# EAGLE board tinylab_09-03-16 (EAGLE 7.5.0), part 1 of 2
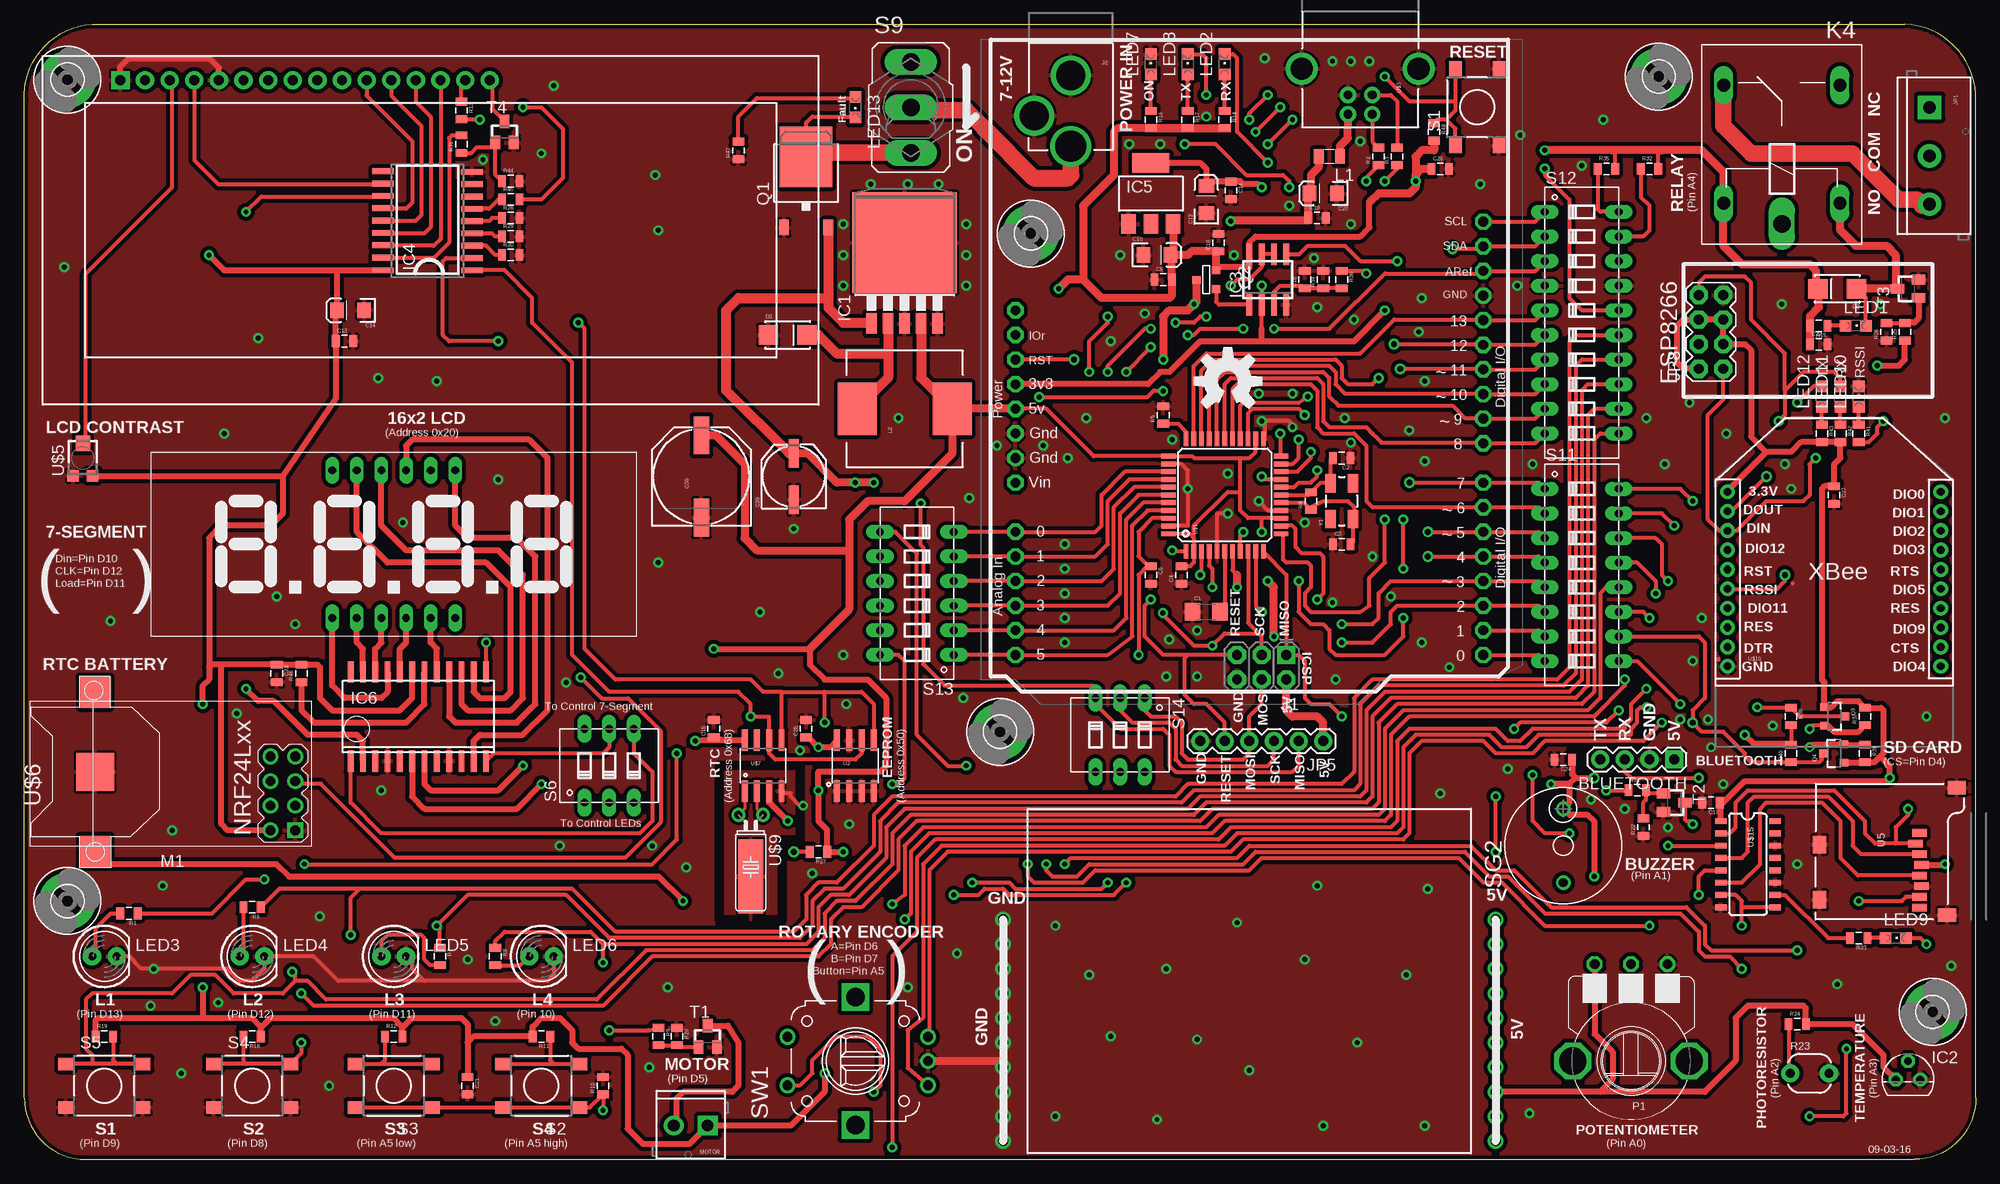
[diagram p2: board, top side]
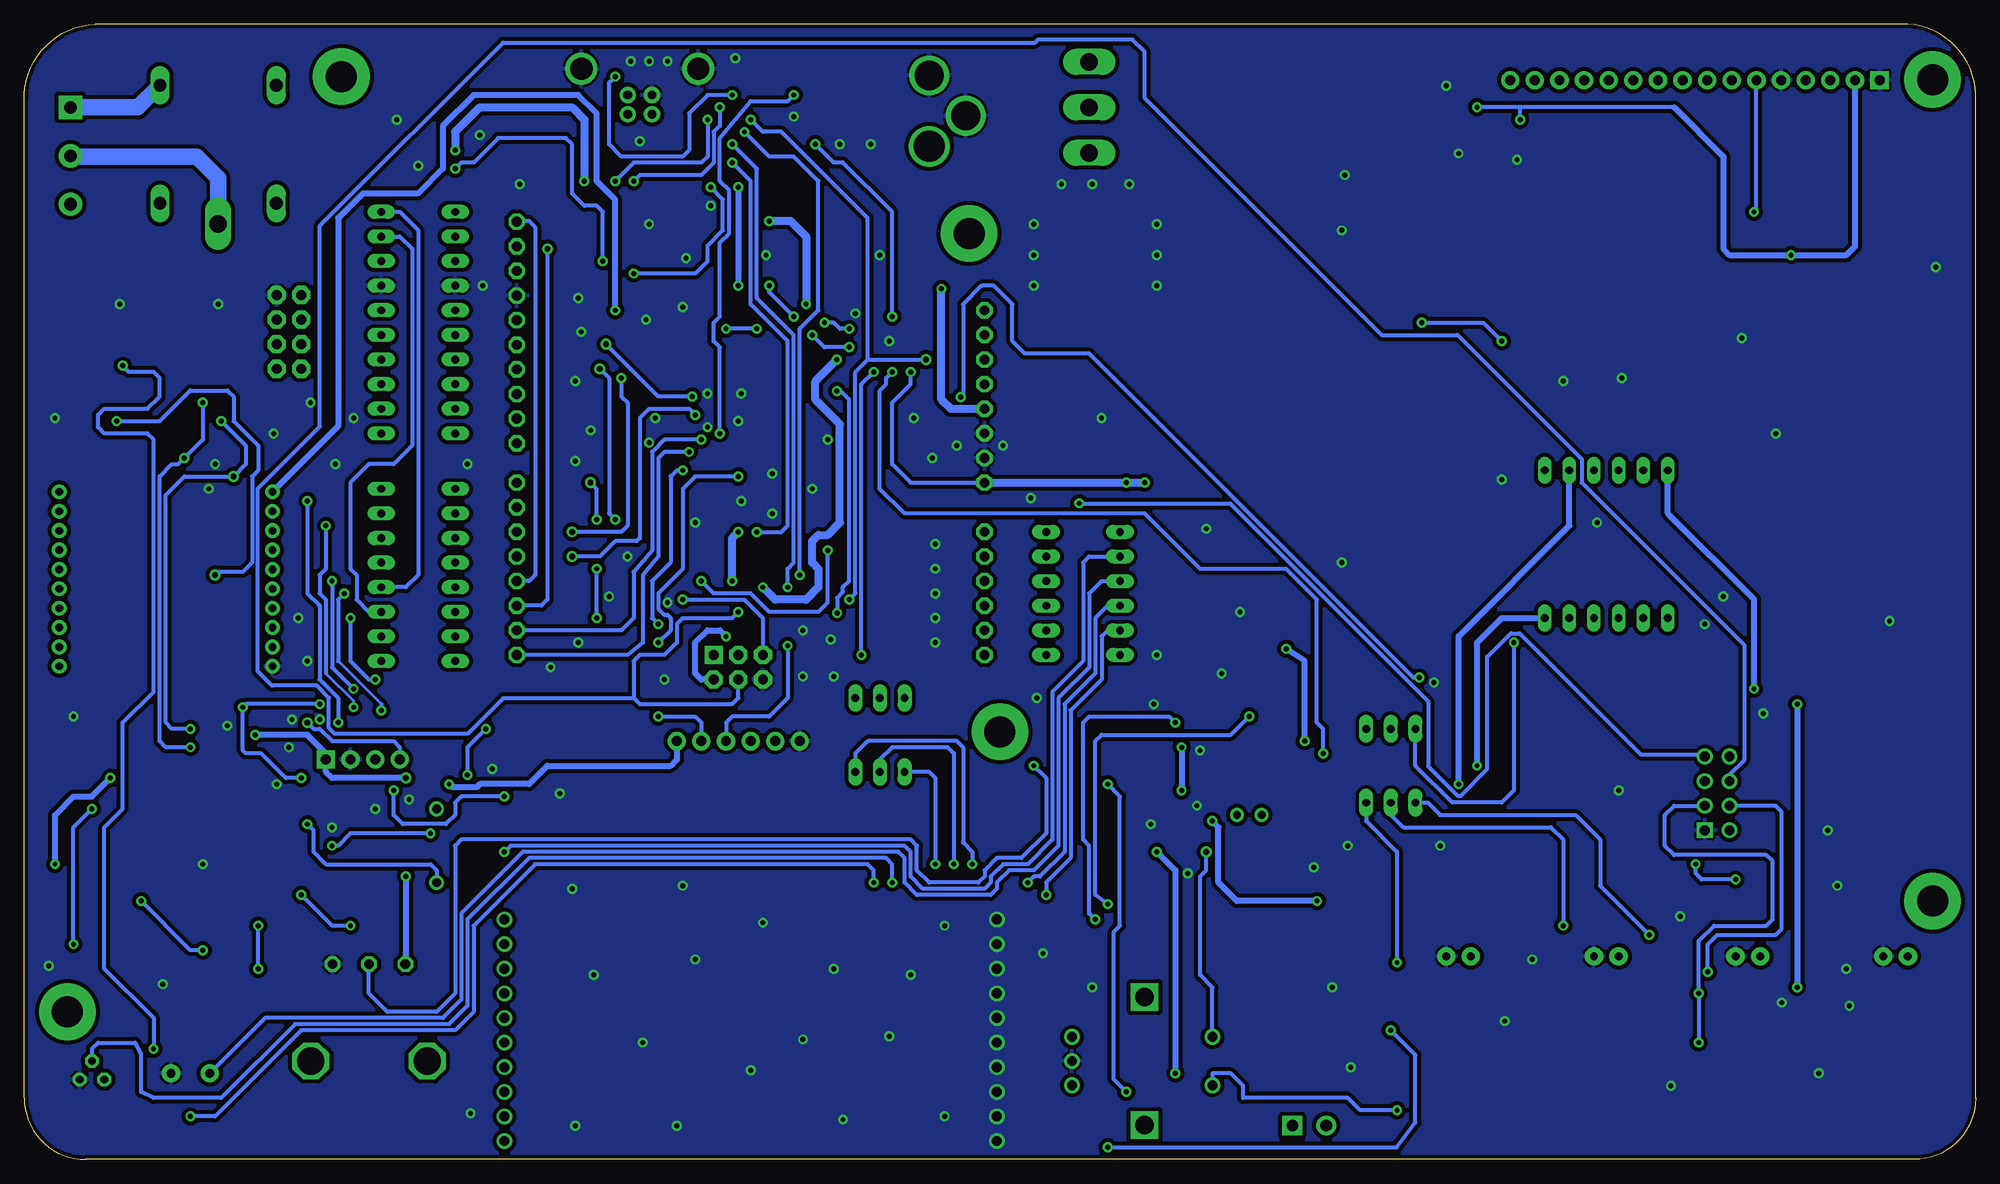
[diagram p3: board, bottom side, seen from below]

Size 201.31 x 117.16 mm. Coordinates in mm from the lower left corner, seen from the top.
Outline: 201.29,6.35 201.29,109.52
Outline: 201.31,6.35 arc-90 194.96,0 6.36,0 arc-90 0.01,6.35 0.01,109.22 arc-90 7,117.16 194,117.16 arc-90 201.31,109.22
Copper layers (1*16): Top 0.035mm / dielectric 1.5mm / Bottom 0.035mm
Design rules "default": minimum track width 16mil, minimum drill 20mil, track to track 8mil, track to pad 12mil, pad to pad 8mil, via to via 8mil, smd to smd 8mil, copper to edge 10mil, drill to drill 8mil, minimum pad ring 12mil, minimum via ring 10mil, stop-mask expansion 4mil, vias tented up to drill 25mil, thermal gap 10mil
tRestrict: 7 lines

## Footprints (pad centres in the part's own frame; a part is rotated, then mirrored left to right if it is on the bottom)
1X04 = drill 1.016 pad 1.88 square: 1 0,0 | drill 1.016 pad 1.88: 2 2.54,0; 3 5.08,0; 4 7.62,0
1206 = smd 1.6 x 1.8: 1 -1.4,0; 2 1.4,0
0805 = smd 0.8 x 1.2: 1 -0.9,0; 2 0.9,0
EIA3216 = smd 1.4 x 1.6: A 1.4,0; C -1.4,0
NIPPON_F80 = smd 2.95 x 1: + 2.4,0; - -2.4,0
PANASONIC_G = smd 3.9 x 1.6: + 4.25,0; - -4.25,0
SMA-DIODE_ALT = smd 2 x 2: A -2,0; C 2,0
3,2-PAD = drill 3.2 pad 5.842: B3,2 0,0
TO263-5 = smd 1.067 x 2.159: 1 -3.404,-5.791; 2 -1.702,-5.791; 3 0,-5.791; 4 1.702,-5.791; 5 3.404,-5.791 | smd 10.8 x 10.41: GND 0,2.54
TO92 = drill 0.813 octagon: 1 -1.27,0; 2 0,1.905; 3 1.27,0
SO08 = smd 0.6 x 2.2: 1 -1.905,-2.6; 2 -0.635,-2.6; 3 0.635,-2.6; 4 1.905,-2.6; 5 1.905,2.6; 6 0.635,2.6; 7 -0.635,2.6; 8 -1.905,2.6
SO18W = smd 0.6 x 2.2: 1 -4.445,-4.6; 2 -3.175,-4.6; 3 -1.905,-4.6; 4 -0.635,-4.6; 5 0.635,-4.6; 6 1.905,-4.6; 7 3.175,-4.6; 8 4.445,-4.6; 9 5.715,-4.6; 10 5.775,4.6; 11 4.505,4.6; 12 3.235,4.6; 13 1.965,4.6; 14 0.695,4.6; 15 -0.575,4.6; 16 -1.845,4.6; 17 -3.145,4.6; 18 -4.445,4.6
SOT223 = smd 1.5 x 2: 1 -2.3,-3.15; 2 0,-3.15; 3 2.3,-3.15 | smd 3.8 x 2: 4 0,3.15
SO24W = smd 0.6 x 2.2: 1 -6.985,-4.6; 2 -5.715,-4.6; 3 -4.445,-4.6; 4 -3.175,-4.6; 5 -1.905,-4.6; 6 -0.635,-4.6; 7 0.635,-4.6; 8 1.905,-4.6; 9 3.175,-4.6; 10 4.445,-4.6; 11 5.715,-4.6; 12 6.985,-4.6; 13 6.985,4.6; 14 5.715,4.6; 15 4.445,4.6; 16 3.175,4.6; 17 1.905,4.6; 18 0.635,4.6; 19 -0.635,4.6; 20 -1.905,4.6; 21 -3.175,4.6; 22 -4.445,4.6; 23 -5.715,4.6; 24 -6.985,4.6
2X3-NS = drill 1.016 pad 1.88 square: 1 -2.54,-1.27 | drill 1.016 pad 1.88 octagon: 2 -2.54,1.27; 3 0,-1.27; 4 0,1.27; 5 2.54,-1.27; 6 2.54,1.27
POWER_JACK_PTH_LOCK = drill 2.997 pad 4.115: GND 0.025,6.557; GNDBREAK 3.762,10.7 | drill 3.2 pad 4.115: PWR 0,13.878
SCREWTERMINAL-5MM-3 = drill 1.3 pad 2.413 square: 1 0,0 | drill 1.3 pad 2.413: 2 5,0; 3 10,0
1X06 = drill 1.016 pad 1.88: 1 0,0; 2 2.54,0; 3 5.08,0; 4 7.62,0; 5 10.16,0; 6 12.7,0
2X4 = drill 1.016 pad 1.88 octagon: 1 -3.81,-1.27; 2 -3.81,1.27; 3 -1.27,-1.27; 4 -1.27,1.27; 5 1.27,-1.27; 6 1.27,1.27; 7 3.81,-1.27; 8 3.81,1.27
ZF112 = drill 1.321 long: 1 -6.096,5.994; 2 -6.096,-5.994; O 6.096,5.994; S 6.096,-5.994 | drill 1.803 long: P -8.204,0
PTC0805 = smd 1 x 1.5: 1 -1.1,0; 2 1.1,0
CDRH125 = smd 5.4 x 4: 1 0,4.9; 2 0,-4.9
CHIPLED_0805 = smd 1.2 x 1.2: A 0,-1.05; C 0,1.05
LED5MM = drill 0.813 pad 1.88: A -1.27,0; K 1.27,0
WIRELESS-NRF24L01 = drill 1 square: 1 -12.7,6.35 | drill 1: 2 -10.16,6.35; 3 -12.7,3.81; 4 -10.16,3.81; 5 -12.7,1.27; 6 -10.16,1.27; 7 -12.7,-1.27; 8 -10.16,-1.27
SCREWTERMINAL-3.5MM-2 = drill 1.2 pad 2.032 square: 1 0,0 | drill 1.2 pad 2.032: 2 3.5,0
P120PK = drill 1 octagon: A -3.75,-10; E 3.75,-10; S 0,-10 | drill 2.8 octagon: M1 -6,0; M2 6,0
TO252 = smd 1 x 1.6: 1 -2.28,-4.8; 2 2.28,-4.8 | smd 5.4 x 6.2: 3 0,2.5
SOT-23 = smd 0.787 x 0.889: 1 0.025,-1.016; 2 -0.94,1.016; 3 0.991,1.016
SOT23-3 = smd 0.8 x 0.9: 1 -0.95,-1; 2 0.95,-1; 3 0,1.1
PHOTOCELL-KIT = drill 0.9 pad 1.88: 1 -2,0; 2 2,0
DTSM-6 = smd 1.55 x 1.3: 1 -3.975,2.25; 2 3.975,2.25; 3 -3.975,-2.25; 4 3.975,-2.25
DIP03YL = drill 0.813 long: 1 -2.54,-3.81; 2 0,-3.81; 3 2.54,-3.81; 4 2.54,3.81; 5 0,3.81; 6 -2.54,3.81
M9040P = drill 1.803 long: 1 0,4.699; 2 0,0; 3 0,-4.699
DIP08YL = drill 0.813 long: 1 -8.89,-3.81; 2 -6.35,-3.81; 3 -3.81,-3.81; 4 -1.27,-3.81; 5 1.27,-3.81; 6 3.81,-3.81; 7 6.35,-3.81; 8 8.89,-3.81; 9 8.89,3.81; 10 6.35,3.81; 11 3.81,3.81; 12 1.27,3.81; 13 -1.27,3.81; 14 -3.81,3.81; 15 -6.35,3.81; 16 -8.89,3.81
DIP10YL = drill 0.813 long: 1 -11.43,-3.81; 2 -8.89,-3.81; 3 -6.35,-3.81; 4 -3.81,-3.81; 5 -1.27,-3.81; 6 1.27,-3.81; 7 3.81,-3.81; 8 6.35,-3.81; 9 8.89,-3.81; 10 11.43,-3.81; 11 11.43,3.81; 12 8.89,3.81; 13 6.35,3.81; 14 3.81,3.81; 15 1.27,3.81; 16 -1.27,3.81; 17 -3.81,3.81; 18 -6.35,3.81; 19 -8.89,3.81; 20 -11.43,3.81
DIP06YL = drill 0.813 long: 1 -6.35,-3.81; 2 -3.81,-3.81; 3 -1.27,-3.81; 4 1.27,-3.81; 5 3.81,-3.81; 6 6.35,-3.81; 7 6.35,3.81; 8 3.81,3.81; 9 1.27,3.81; 10 -1.27,3.81; 11 -3.81,3.81; 12 -6.35,3.81
BMT1205XH7.5 = drill 0.9 pad 1.5: + 3.8,0; - -3.8,0
PEC12_INCREMENTAL_ENCODER = drill 1: A -2.5,-7.5; B 2.5,-7.5; C 0,-7.5; P1 -2.5,7; P2 2.5,7 | drill 1.9 square: GND@1 -6.6,0; GND@2 6.6,0
SOT23-BEC = smd 1 x 1.4: B -0.95,-1.1; C 0,1.1; E 0.95,-1.1
LCD-16X2 = drill 1.016 pad 1.88 square: 1 -32,15.5 | drill 1.016 pad 1.88: 2 -29.46,15.5; 3 -26.92,15.5; 4 -24.38,15.5; 5 -21.84,15.5; 6 -19.3,15.5; 7 -16.76,15.5; 8 -14.22,15.5; 9 -11.68,15.5; 10 -9.14,15.5; 11 -6.6,15.5; 12 -4.06,15.5; 13 -1.52,15.5; 14 1.02,15.5; 15 3.56,15.5; 16 6.1,15.5
SO08' = smd 0.61 x 2.21: 1 -1.905,-2.616; 2 -0.635,-2.616; 3 0.635,-2.616; 4 1.905,-2.616; 5 1.905,2.616; 6 0.635,2.616; 7 -0.635,2.616; 8 -1.905,2.616
MICRO-SD-SOCKET-PP = smd 0.8 x 1.5: 1 -8.94,10.7; 2 -7.84,10.3; 3 -6.74,10.7; 4 -5.64,10.9; 5 -4.54,10.7; 6 -3.44,10.9; 7 -2.34,10.7; 8 -1.24,10.7 | smd 1.8 x 1.4: CD1 -2.05,0.4; CD2 -7.75,0.4 | smd 1.4 x 1.9: GND1 -13.6,14.55; GND3 -0.45,13.55
TQFP44 = smd 1.5 x 0.5: 1 -5.8,4; 2 -5.8,3.2; 3 -5.8,2.4; 4 -5.8,1.6; 5 -5.8,0.8; 6 -5.8,0; 7 -5.8,-0.8; 8 -5.8,-1.6; 9 -5.8,-2.4; 10 -5.8,-3.2; 11 -5.8,-4; 23 5.8,-4; 24 5.8,-3.2; 25 5.8,-2.4; 26 5.8,-1.6; 27 5.8,-0.8; 28 5.8,0; 29 5.8,0.8; 30 5.8,1.6; 31 5.8,2.4; 32 5.8,3.2; 33 5.8,4 | smd 0.5 x 1.5: 12 -4,-5.8; 13 -3.2,-5.8; 14 -2.4,-5.8; 15 -1.6,-5.8; 16 -0.8,-5.8; 17 0,-5.8; 18 0.8,-5.8; 19 1.6,-5.8; 20 2.4,-5.8; 21 3.2,-5.8; 22 4,-5.8; 34 4,5.8; 35 3.2,5.8; 36 2.4,5.8; 37 1.6,5.8; 38 0.8,5.8; 39 0,5.8; 40 -0.8,5.8; 41 -1.6,5.8; 42 -2.4,5.8; 43 -3.2,5.8; 44 -4,5.8
USB-B-PTH = drill 0.914 pad 1.676: D+ 0,1.25; D- 1.981,1.25; GND 0,-1.25; VBUS 1.981,-1.25 | drill 2.286: S1 -2.718,-6.02; S2 -2.718,6.02
UNO_R3 = drill 1 pad 1.676 octagon: 3V 35.56,2.54; 5V 38.1,2.54; A0 50.8,2.54; A1 53.34,2.54; A2 55.88,2.54; A3 58.42,2.54; A4 60.96,2.54; A5 63.5,2.54; AREF 23.876,50.8; D0 63.5,50.8; D1 60.96,50.8; D2 58.42,50.8; D3 55.88,50.8; D4 53.34,50.8; D5 50.8,50.8; D6 48.26,50.8; D7 45.72,50.8; D8 41.656,50.8; D9 39.116,50.8; D10 36.576,50.8; D11 34.036,50.8; D12 31.496,50.8; D13 28.956,50.8; GND 26.416,50.8; GND1 43.18,2.54; GND2 40.64,2.54; IOREF 30.48,2.54; RESERVED 27.94,2.54; RESET 33.02,2.54; SCL 18.796,50.8; SDA 21.336,50.8; VIN 45.72,2.54
TC33X = smd 1.2 x 1.2: 1 -1,-1.825; 3 1,-1.825 | smd 1.5 x 1.6: 2 0,1.5
CR1220-SMD = smd 3.2 x 3.2: +$1 -8.2,0; +$2 8.2,0 | smd 3.9 x 3.9: - 0,0
TC38H_GNDPAD = drill 0.813: 1 -1.27,0; 2 1.27,0 | smd 2.54 x 7.62: P$1 0,6.35
XBEE-SILK = drill 0.8 pad 1.524: 1 -11,20; 2 -11,18; 3 -11,16; 4 -11,14; 5 -11,12; 6 -11,10; 7 -11,8; 8 -11,6; 9 -11,4; 10 -11,2; 11 11,2; 12 11,4; 13 11,6; 14 11,8; 15 11,10; 16 11,12; 17 11,14; 18 11,16; 19 11,18; 20 11,20
MYLIB_LDQ_4D_7SEG = drill 0.8 long: 1 -6.35,-7.62; 2 -3.81,-7.62; 3 -1.27,-7.62; 4 1.27,-7.62; 5 3.81,-7.62; 6 6.35,-7.62; 7 6.35,7.62; 8 3.81,7.62; 9 1.27,7.62; 10 -1.27,7.62; 11 -3.81,7.62; 12 -6.35,7.62
SO016 = smd 0.6 x 1.2: 1 -4.445,-2.8; 2 -3.175,-2.8; 3 -1.905,-2.8; 4 -0.635,-2.8; 5 0.635,-2.8; 6 1.905,-2.8; 7 3.175,-2.8; 8 4.445,-2.8; 9 4.445,2.8; 10 3.175,2.8; 11 1.905,2.8; 12 0.635,2.8; 13 -0.635,2.8; 14 -1.905,2.8; 15 -3.175,2.8; 16 -4.445,2.8
CRYSTAL-SMD-5X3 = smd 1.9 x 1.1: 1 -1.85,-1.15; 2 1.85,-1.15; 3 1.85,1.15; 4 -1.85,1.15

## Placement (x,y rotation side)
BLUETOOTH  [1X04]  170.19,41.28 180 top
C1  1uF  [1206]  121.93,56.52 0 top
C2  22pF  [0805]  135.9,72.39 180 top
C3  22pF  [0805]  135.9,63.5 0 top
C4  100nF  [0805]  119.39,60.33 90 top
C5  100nF  [0805]  117.49,90.8 0 top
C6  100nF  [0805]  116.22,60.33 270 top
C10  10uF  [EIA3216]  116.85,93.34 0 top
C11  100nF  [0805]  124.47,100.01 270 top
C12  10uF  [EIA3216]  121.93,99.06 90 top
C13  100nf  [0805]  33.03,84.45 0 top
C14  10uf  [EIA3216]  33.67,87.63 180 top
C15  100nF  [0805]  71.13,44.45 90 top
C16  100nF  [0805]  123.2,94.61 90 top
C17  100nF  [0805]  174,36.83 180 top
C18  100nF  [0805]  132.09,90.8 90 top
C19  100nF  [0805]  133.36,97.16 0 top
C20  10uF  [EIA3216]  134,99.69 180 top
C21  100nF  [0805]  45.73,7.62 270 top
C22  100nF  [0805]  185.11,84.14 0 top
C23  100nf  [0805]  26.05,50.17 270 top
C24  100nF  [0805]  158.76,41.28 180 top
C25  100nF  [0805]  80.66,44.45 90 top
C26  100nF  [0805]  146.06,102.23 0 top
C27  100nF  [0805]  186.7,68.58 270 top
C28  100uF  [NIPPON_F80]  79.39,70.48 90 top
C30  470uF  [PANASONIC_G]  69.86,70.48 90 top
D1  1N4007  [SMA-DIODE_ALT]  78.75,85.09 0 top
D2  1N4007  [SMA-DIODE_ALT]  187.02,89.85 180 top
H1  MOUNT-PAD-ROUND3.2  [3,2-PAD]  4.46,26.67 0 top
H2  MOUNT-PAD-ROUND3.2  [3,2-PAD]  100.66,44.13 0 top
H3  MOUNT-PAD-ROUND3.2  [3,2-PAD]  196.86,15.24 0 top
H4  MOUNT-PAD-ROUND3.2  [3,2-PAD]  168.6,111.76 0 top
H5  MOUNT-PAD-ROUND3.2  [3,2-PAD]  4.46,111.44 0 top
H6  MOUNT-PAD-ROUND3.2  [3,2-PAD]  103.83,95.57 0 top
IC1  LM2575S  [TO263-5]  90.82,92.08 0 top
IC2  LM35CZ  [TO92]  194.32,8.26 0 top
IC3  LM358MX  [SO08]  128.28,90.8 0 top
IC4  MCP2300X/SO  [SO18W]  41.6,96.2 90 top
IC5  LD117AS33TR  [SOT223]  116.22,99.69 0 top
IC6  MAX7219CWG  [SO24W]  40.65,45.72 0 top
J1  AVR_SPI_PRG_6NS  [2X3-NS]  127.65,50.8 180 top
J2  POWER_JACKPTH_LOCK  [POWER_JACK_PTH_LOCK]  107.96,118.43 180 top
JP1  [SCREWTERMINAL-5MM-3]  196.54,108.58 270 top
JP5  [1X06]  134,43.18 180 top
JP8  [2X4]  174,85.41 90 top
K4  ZF112  [ZF112]  181.3,104.77 90 top
L1  [PTC0805]  134.63,103.5 180 top
L2  [CDRH125]  90.82,77.47 90 top
LED1  Blue  [CHIPLED_0805]  188.92,86.04 270 top
LED2  Green  [CHIPLED_0805]  123.84,113.03 0 top
LED3  RED  [LED5MM]  8.27,20.95 0 top
LED4  RED  [LED5MM]  23.51,20.95 0 top
LED5  RED  [LED5MM]  38.11,20.95 0 top
LED6  RED  [LED5MM]  53.35,20.95 0 top
LED7  Yellow  [CHIPLED_0805]  116.22,113.03 0 top
LED8  Green  [CHIPLED_0805]  120.03,113.03 0 top
LED9  Blue  [CHIPLED_0805]  193.05,22.86 270 top
LED10  Yellow  [CHIPLED_0805]  189.24,78.74 0 top
LED11  Red  [CHIPLED_0805]  187.34,78.74 0 top
LED12  Blue  [CHIPLED_0805]  185.43,78.74 0 top
LED13  Red  [CHIPLED_0805]  85.74,108.58 180 top
M1  WIRELESS-NRF24L01  [WIRELESS-NRF24L01]  15.25,40.32 180 top
MOTOR  [SCREWTERMINAL-3.5MM-2]  70.5,3.49 180 top
P1  P120PK  [P120PK]  165.75,10.16 180 top
Q1  FDD4141 or FDD6637  [TO252]  80.66,100.96 0 top
Q2  FDN340  [SOT-23]  121.93,90.8 270 top
Q3  BSS138  [SOT23-3]  186.7,45.72 270 top
Q4  BSS138  [SOT23-3]  186.7,41.91 90 top
R1  330  [0805]  10.81,25.4 180 top
R2  22  [0805]  139.71,103.5 90 top
R3  22  [0805]  141.62,103.5 90 top
R4  1M  [0805]  132.73,67.94 90 top
R5  10K  [0805]  117.49,76.83 90 top
R6  330  [0805]  23.51,26.04 180 top
R7  330  [0805]  42.87,20.95 270 top
R8  330  [0805]  48.59,20.95 270 top
R9  1k  [0805]  65.42,12.7 270 top
R10  1k  [0805]  59.7,7.62 90 top
R11  1k  [0805]  53.35,12.7 180 top
R12  3.9k  [0805]  38.11,12.7 0 top
R13  100R  [0805]  45.1,108.27 270 top
R14  330  [0805]  123.84,107.31 270 top
R15  1k  [0805]  185.11,86.04 180 top
R16  330  [0805]  116.22,107.31 270 top
R17  330  [0805]  120.03,107.31 270 top
R18  10k  [0805]  23.51,12.7 180 top
R19  10k  [0805]  8.27,12.7 0 top
R20  10k  [0805]  67.32,12.7 270 top
R21  1k  [0805]  166.38,38.1 0 top
R22  10k  [0805]  167.02,34.29 90 top
R23  PHOTOCELLPTH-KIT  [PHOTOCELL-KIT]  184.16,8.89 0 top
R24  10k  [0805]  182.89,13.97 0 top
R25  1k  [0805]  194,85.41 90 top
R26  10k  [0805]  192.1,85.41 90 top
R27  10k  [0805]  81.93,31.75 180 top
R28  10k  [0805]  50.18,97.16 0 top
R29  10k  [0805]  50.18,95.25 0 top
R30  10k  [0805]  50.18,93.34 0 top
R31  1k  [0805]  45.1,104.77 90 top
R32  4.7k  [0805]  167.65,102.23 0 top
R33  1k  [0805]  189.24,22.86 180 top
R34  10K  [0805]  134,90.8 90 top
R35  4.7k  [0805]  163.21,102.23 0 top
R36  10K  [0805]  135.9,90.8 270 top
R37  10K  [0805]  189.88,45.72 90 top
R38  10K  [0805]  182.26,45.72 270 top
R39  10K  [0805]  189.88,41.91 270 top
R40  10K  [0805]  182.26,41.91 90 top
R41  1K  [0805]  189.24,74.93 270 top
R42  1K  [0805]  187.34,74.93 270 top
R43  1K  [0805]  185.43,74.93 270 top
R44  10k  [0805]  50.18,100.96 0 top
R45  10k  [0805]  50.18,99.06 0 top
R46  30k  [0805]  28.59,50.17 90 top
R47  1k  [0805]  73.67,104.14 90 top
R48  10k  [0805]  145.43,106.05 270 top
S1  DTSM-6  [DTSM-6]  149.87,108.58 90 top
S2  DTSM-6  [DTSM-6]  53.35,7.62 180 top
S3  DTSM-6  [DTSM-6]  38.11,7.62 180 top
S4  DTSM-6  [DTSM-6]  23.51,7.62 0 top
S5  DTSM-6  [DTSM-6]  8.27,7.62 0 top
S6  [DIP03YL]  60.34,40.64 0 top
S9  [M9040P]  91.45,108.58 0 top
S11  [DIP08YL]  160.67,60.33 270 top
S12  [DIP10YL]  160.67,86.36 270 top
S13  [DIP06YL]  92.09,58.42 90 top
S14  [DIP03YL]  113.04,43.82 180 top
SG2  BMT1205XH7.5  [BMT1205XH7.5]  158.76,32.38 90 top
SW1  ENCODER_SW1-PEC12  [PEC12_INCREMENTAL_ENCODER]  85.74,10.16 90 top
T1  BC847  [SOT23-BEC]  70.5,12.7 0 top
T2  BC847  [SOT23-BEC]  170.19,36.83 270 top
T3  BC847  [SOT23-BEC]  194.32,89.85 90 top
T4  BC847  [SOT23-BEC]  49.54,106.05 0 top
U1  LCD-16X2SILK  [LCD-16X2]  41.92,95.88 0 top
U2  24LC256  [SO08']  85.74,40.64 0 top
U5  USD-SOCKETNEW  [MICRO-SD-SOCKET-PP]  184.8,24.77 270 top
U$1  ATMEGA32U4TQFP-44  [TQFP44]  123.84,68.58 90 top
U$2  BREADBOARDMINI  [BREADBOARD-MINI]  149.24,36.2 180 top
U$3  USB+SHIELD  [USB-B-PTH]  137.81,109.85 270 top
U$4  UNO_R3  [UNO_R3]  99.71,115.57 270 top
U$5  10k  [TC33X]  6.04,72.39 0 top
U$6  [CR1220-SMD]  7.31,40.01 90 top
U$7  DS1307SO8  [SO08']  76.21,40.64 0 top
U$9  CRYSTAL_GNDPAD  [TC38H_GNDPAD]  74.94,35.56 180 top
U$10  XBEE-1B2  [XBEE-SILK]  186.7,48.9 0 top
U$11  [TINYLAB_LOGO_LARGE]  31.13,22.54 0 top
U$13  MYLIB_LCQ_4D_7SEG  [MYLIB_LDQ_4D_7SEG]  38.11,63.5 0 top
U$14  [OSHW-LOGO-L]  124.15,80.33 0 top
U$15  74HC4050  [SO016]  177.81,30.48 270 top
Y1  16Mhz  [CRYSTAL-SMD-5X3]  135.9,67.94 90 top